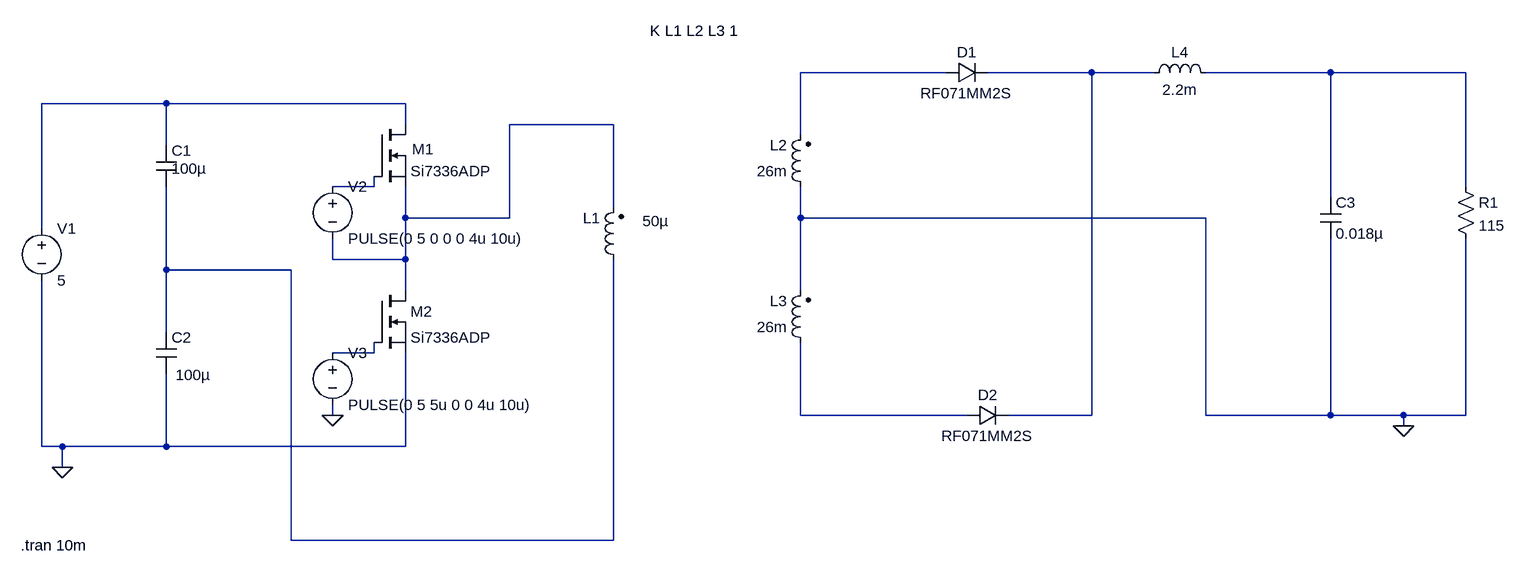
[diagram p0: schematic half bridge converter.asc]
half bridge converter.asc, the LTspice schematic file:
Version 4
SHEET 1 2312 680
WIRE 1424 -144 1200 -144
WIRE 1648 -144 1488 -144
WIRE 1744 -144 1648 -144
WIRE 2016 -144 1824 -144
WIRE 2224 -144 2016 -144
WIRE 224 -96 32 -96
WIRE 592 -96 224 -96
WIRE 592 -64 592 -96
WIRE 912 -64 752 -64
WIRE 1200 -48 1200 -144
WIRE 224 -32 224 -96
WIRE 544 32 544 16
WIRE 544 32 480 32
WIRE 2224 32 2224 -144
WIRE 2016 48 2016 -144
WIRE 912 64 912 -64
WIRE 592 80 592 32
WIRE 752 80 752 -64
WIRE 752 80 592 80
WIRE 1200 80 1200 32
WIRE 1824 80 1200 80
WIRE 32 96 32 -96
WIRE 480 144 480 112
WIRE 592 144 592 80
WIRE 592 144 480 144
WIRE 224 160 224 32
WIRE 416 160 224 160
WIRE 592 192 592 144
WIRE 1200 192 1200 80
WIRE 224 256 224 160
WIRE 544 288 544 272
WIRE 544 288 480 288
WIRE 480 384 480 368
WIRE 1200 384 1200 272
WIRE 1456 384 1200 384
WIRE 1648 384 1648 -144
WIRE 1648 384 1520 384
WIRE 1824 384 1824 80
WIRE 2016 384 2016 112
WIRE 2016 384 1824 384
WIRE 2128 384 2016 384
WIRE 2224 384 2224 112
WIRE 2224 384 2128 384
WIRE 2128 400 2128 384
WIRE 32 432 32 176
WIRE 64 432 32 432
WIRE 224 432 224 320
WIRE 224 432 64 432
WIRE 592 432 592 288
WIRE 592 432 224 432
WIRE 64 464 64 432
WIRE 416 576 416 160
WIRE 912 576 912 144
WIRE 912 576 416 576
FLAG 64 464 0
FLAG 480 384 0
FLAG 2128 400 0
SYMBOL voltage 32 80 R0
WINDOW 123 0 0 Left 0
WINDOW 39 0 0 Left 0
SYMATTR InstName V1
SYMATTR Value 5
SYMBOL cap 208 -32 R0
WINDOW 3 24 36 Left 2
SYMATTR Value 100µ
SYMATTR InstName C1
SYMATTR SpiceLine V=2.5 Irms=0 Rser=0 Lser=0 mfg="Murata" pn="GRM21BR60E107ME15" type="X5R"
SYMBOL cap 208 256 R0
WINDOW 3 30 66 Left 2
SYMATTR Value 100µ
SYMATTR InstName C2
SYMATTR SpiceLine V=2.5 Irms=0 Rser=0 Lser=0
SYMBOL nmos 544 -64 R0
WINDOW 0 58 38 Left 2
SYMATTR InstName M1
SYMATTR Value Si7336ADP
SYMBOL nmos 544 192 R0
SYMATTR InstName M2
SYMATTR Value Si7336ADP
SYMBOL ind2 928 160 R180
WINDOW 0 36 80 Left 2
WINDOW 3 -69 75 Left 2
SYMATTR InstName L1
SYMATTR Value 50µ
SYMATTR Type ind
SYMBOL ind2 1216 48 R180
WINDOW 0 36 80 Left 2
WINDOW 3 36 40 Left 2
SYMATTR InstName L2
SYMATTR Value 26m
SYMATTR Type ind
SYMBOL ind2 1216 288 R180
WINDOW 0 36 80 Left 2
WINDOW 3 36 40 Left 2
SYMATTR InstName L3
SYMATTR Value 26m
SYMATTR Type ind
SYMBOL voltage 480 16 R0
WINDOW 123 0 0 Left 0
WINDOW 39 0 0 Left 0
SYMATTR InstName V2
SYMATTR Value PULSE(0 5 0 0 0 4u 10u)
SYMBOL voltage 480 272 R0
WINDOW 123 0 0 Left 0
WINDOW 39 0 0 Left 0
SYMATTR InstName V3
SYMATTR Value PULSE(0 5 5u 0 0 4u 10u)
SYMBOL diode 1424 -128 R270
WINDOW 0 32 32 VTop 2
WINDOW 3 0 32 VBottom 2
SYMATTR InstName D1
SYMATTR Value RF071MM2S
SYMBOL diode 1456 400 R270
WINDOW 0 32 32 VTop 2
WINDOW 3 0 32 VBottom 2
SYMATTR InstName D2
SYMATTR Value RF071MM2S
SYMBOL ind 1728 -128 R270
WINDOW 0 32 56 VTop 2
WINDOW 3 5 56 VBottom 2
SYMATTR InstName L4
SYMATTR Value 2.2m
SYMATTR SpiceLine Ipk=0.77 Rser=1.7286 Rpar=207240 Cpar=0 mfg="Coilcraft" pn="RFS1317-225"
SYMBOL cap 2000 48 R0
SYMATTR InstName C3
SYMATTR Value 0.018µ
SYMATTR SpiceLine V=100 Irms=0 Rser=0 Lser=0 mfg="Murata" pn="GCM188R72A183KA37" type="X7R"
SYMBOL res 2208 16 R0
SYMATTR InstName R1
SYMATTR Value 115
SYMATTR SpiceLine tol=1 pwr=0.1
TEXT 968 -208 Left 2 !K L1 L2 L3 1
TEXT 0 584 Left 2 !.tran 10m

The netlist it stands for:
* half bridge converter.asc
V1 N004 0 5
C1 N004 N007 100µ V=2.5 Irms=0 Rser=0 Lser=0 mfg="Murata" pn="GRM21BR60E107ME15" type="X5R"
C2 N007 0 100µ V=2.5 Irms=0 Rser=0 Lser=0
M1 N004 N006 N005 N005 Si7336ADP
M2 N005 N008 0 0 Si7336ADP
L1 N007 N005 50µ
L2 0 N001 26m
L3 N009 0 26m
V2 N006 N005 PULSE(0 5 0 0 0 4u 10u)
V3 N008 0 PULSE(0 5 5u 0 0 4u 10u)
D1 N001 N002 RF071MM2S
D2 N009 N002 RF071MM2S
L4 N002 N003 2.2m Ipk=0.77 Rser=1.7286 Rpar=207240 Cpar=0 mfg="Coilcraft" pn="RFS1317-225"
C3 N003 0 0.018µ V=100 Irms=0 Rser=0 Lser=0 mfg="Murata" pn="GCM188R72A183KA37" type="X7R"
R1 N003 0 115 tol=1 pwr=0.1
.model D D
.lib standard.dio
.model NMOS NMOS
.model PMOS PMOS
.lib standard.mos
K L1 L2 L3 1
.tran 10m
.backanno
.end